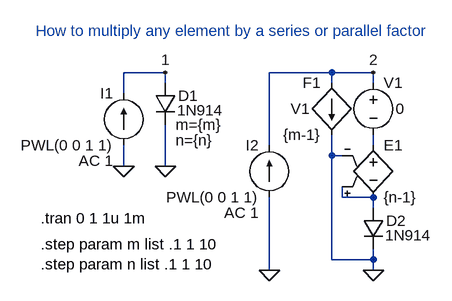
[diagram p0: schematic SeriesParallel.asc]
SeriesParallel.asc, the LTspice schematic file:
Version 4
SHEET 1 880 680
WIRE -240 32 -304 32
WIRE 16 32 -80 32
WIRE 80 32 16 32
WIRE -240 48 -240 32
WIRE 16 48 16 32
WIRE 80 48 80 32
WIRE -304 64 -304 32
WIRE -80 144 -80 32
WIRE 80 144 80 128
WIRE 16 160 16 128
WIRE 32 160 16 160
WIRE -304 176 -304 144
WIRE -240 176 -240 112
WIRE 32 224 32 208
WIRE 80 224 32 224
WIRE 80 240 80 224
WIRE 16 320 16 160
WIRE 80 320 80 304
WIRE 80 320 16 320
WIRE -80 336 -80 224
WIRE 80 336 80 320
FLAG -80 336 0
FLAG 80 336 0
FLAG -304 176 0
FLAG -240 176 0
FLAG -240 32 1
FLAG 80 32 2
SYMBOL diode -256 48 R0
WINDOW 123 32 64 Left 0
WINDOW 39 32 88 Left 0
WINDOW 0 36 20 Left 0
WINDOW 3 34 42 Left 0
SYMATTR Value2 m={m}
SYMATTR SpiceLine n={n}
SYMATTR InstName D1
SYMATTR Value 1N914
SYMBOL diode 64 240 R0
WINDOW 0 36 20 Left 0
WINDOW 3 34 42 Left 0
SYMATTR InstName D2
SYMATTR Value 1N914
SYMBOL f 16 48 M0
WINDOW 3 34 40 Left 0
WINDOW 123 16 80 Left 0
WINDOW 0 16 0 Left 0
SYMATTR Value V1
SYMATTR Value2 {m-1}
SYMATTR InstName F1
SYMBOL voltage 80 32 R0
WINDOW 3 34 56 Left 0
WINDOW 0 16 16 Left 0
SYMATTR Value 0
SYMATTR InstName V1
SYMBOL current -304 144 R180
WINDOW 0 16 80 Left 0
WINDOW 3 16 0 Left 0
WINDOW 123 16 -24 Left 0
WINDOW 39 0 0 Left 0
SYMATTR InstName I1
SYMATTR Value PWL(0 0 1 1)
SYMATTR Value2 AC 1
SYMBOL current -80 224 R180
WINDOW 0 16 80 Left 0
WINDOW 3 16 0 Left 0
WINDOW 123 16 -24 Left 0
WINDOW 39 0 0 Left 0
SYMATTR InstName I2
SYMATTR Value PWL(0 0 1 1)
SYMATTR Value2 AC 1
SYMBOL e2 80 128 R0
WINDOW 0 16 16 Left 0
WINDOW 3 16 96 Left 0
SYMATTR InstName E1
SYMATTR Value {n-1}
TEXT -432 256 Left 0 !.tran 0 1 1u 1m
TEXT -432 296 Left 0 !.step param m list .1 1 10\n.step param n list .1 1 10
TEXT -136 -32 Center 0 ;How to multiply any element by a series or parallel factor

The netlist it stands for:
* SeriesParallel.asc
D1 1 0 1N914 m={m} n={n}
D2 N002 0 1N914
F1 2 0 V1 {m-1}
V1 2 N001 0
I1 0 1 PWL(0 0 1 1) AC 1
I2 0 2 PWL(0 0 1 1) AC 1
E1 N001 N002 N002 0 {n-1}
.model D D
.lib standard.dio
.tran 0 1 1u 1m
.step param m list .1 1 10
.step param n list .1 1 10
* How to multiply any element by a series or parallel factor
.backanno
.end